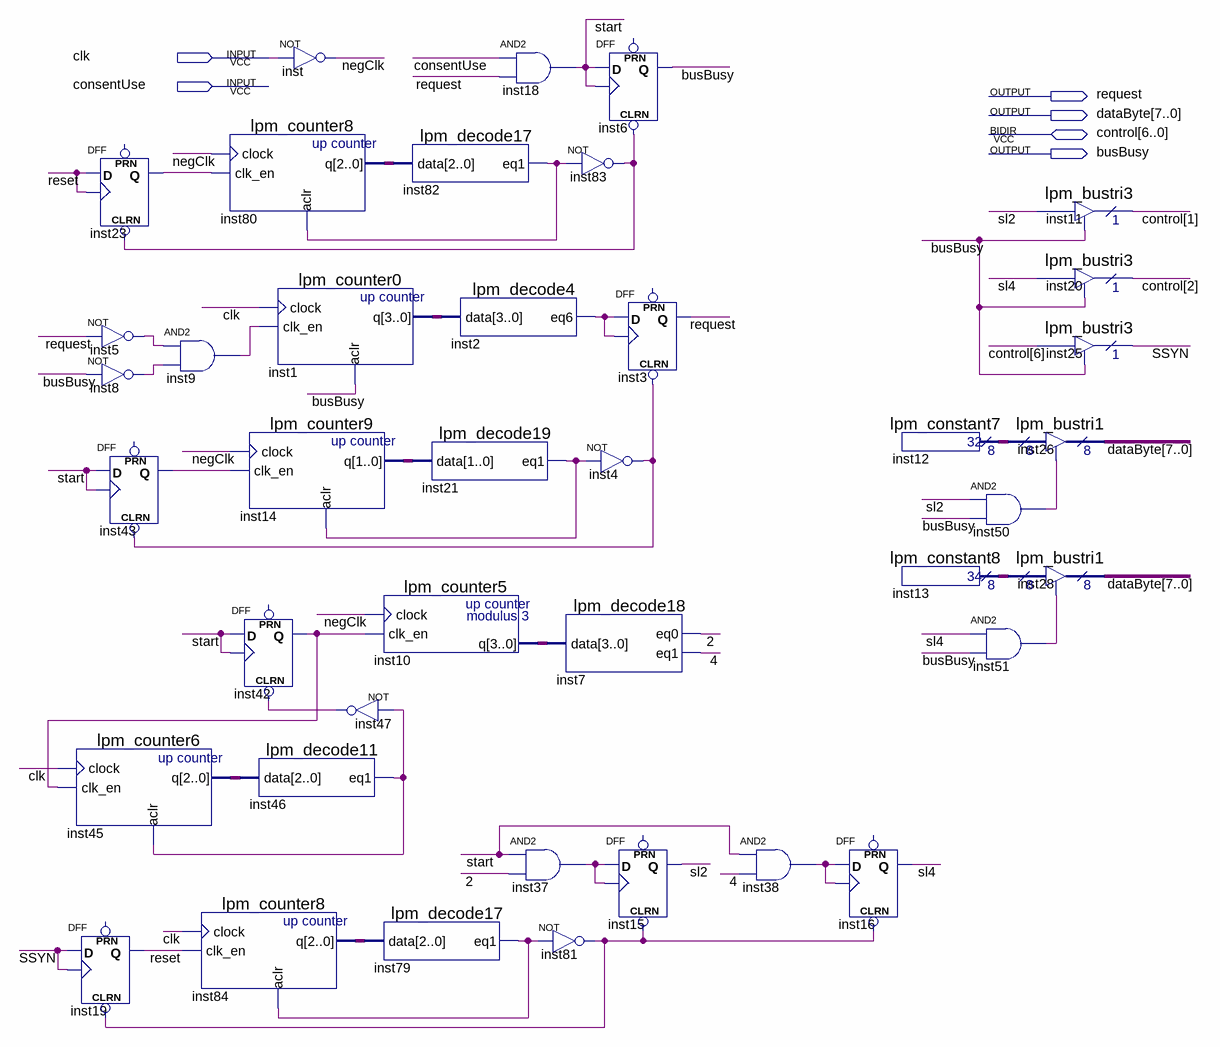
[diagram p0: schematic sheet]
// Quartus schematic Master3.bdf as structural Verilog: 40 symbols, 6 pins
module Master3 (
  input  clk,
  input  consentUse,
  inout  [6:0] control,
  output request,
  output [7:0] dataByte,
  output busBusy
);

  wire \2 , \4 , inst2_eq6, inst4_out, inst5_out, inst8_out, inst9_out, inst21_eq1, inst23_q, inst37_out,
       inst38_out, inst42_q, inst43_q, inst46_eq1, inst47_out, inst50_out, inst51_out, inst79_eq1,
       inst81_out, inst82_eq1, inst83_out, negClk, reset, sl2, sl4, SSYN, start;
  wire [1:0] inst14_q;
  wire [2:0] inst45_q, inst80_q, inst84_q;
  wire [3:0] inst1_q, inst10_q;
  wire [7:0] inst12_result, inst13_result;

  lpm_counter6 inst45 (.clock(clk), .clk_en(inst42_q), .aclr(inst46_eq1), .q(inst45_q));
  DFF inst19 (.CLRN(inst81_out), .CLK(SSYN), .D(SSYN), .Q(reset));  // open: PRN
  DFF inst23 (.CLRN(inst83_out), .CLK(reset), .D(reset), .Q(inst23_q));  // open: PRN
  not inst5 (inst5_out, request);
  not inst8 (inst8_out, busBusy);
  DFF inst43 (.CLRN(inst4_out), .CLK(start), .D(start), .Q(inst43_q));  // open: PRN
  lpm_counter8 inst80 (.clock(negClk), .clk_en(inst23_q), .aclr(inst82_eq1), .q(inst80_q));
  and inst9 (inst9_out, inst5_out, inst8_out);
  lpm_counter8 inst84 (.clock(clk), .clk_en(reset), .aclr(inst79_eq1), .q(inst84_q));
  not inst (negClk, clk);
  lpm_counter0 inst1 (.clock(clk), .clk_en(inst9_out), .aclr(busBusy), .q(inst1_q));
  lpm_counter9 inst14 (.clock(negClk), .clk_en(inst43_q), .aclr(inst21_eq1), .q(inst14_q));
  DFF inst42 (.CLRN(inst47_out), .CLK(start), .D(start), .Q(inst42_q));  // open: PRN
  lpm_decode11 inst46 (.data(inst45_q), .eq1(inst46_eq1));
  lpm_counter5 inst10 (.clock(negClk), .clk_en(inst42_q), .q(inst10_q));
  not inst47 (inst47_out, inst46_eq1);
  lpm_decode17 inst79 (.data(inst84_q), .eq1(inst79_eq1));
  lpm_decode17 inst82 (.data(inst80_q), .eq1(inst82_eq1));
  lpm_decode4 inst2 (.data(inst1_q), .eq6(inst2_eq6));
  lpm_decode19 inst21 (.data(inst14_q), .eq1(inst21_eq1));
  and inst18 (start, consentUse, request);
  and inst37 (inst37_out, start, \2 );
  DFF inst6 (.CLRN(inst83_out), .CLK(start), .D(start), .Q(busBusy));  // open: PRN
  not inst83 (inst83_out, inst82_eq1);
  not inst4 (inst4_out, inst21_eq1);
  lpm_decode18 inst7 (.data(inst10_q), .eq0(\2 ), .eq1(\4 ));
  DFF inst15 (.CLRN(inst81_out), .CLK(inst37_out), .D(inst37_out), .Q(sl2));  // open: PRN
  not inst81 (inst81_out, inst79_eq1);
  DFF inst3 (.CLRN(inst4_out), .CLK(inst2_eq6), .D(inst2_eq6), .Q(request));  // open: PRN
  and inst38 (inst38_out, start, \4 );
  DFF inst16 (.CLRN(inst81_out), .CLK(inst38_out), .D(inst38_out), .Q(sl4));  // open: PRN
  lpm_constant7 inst12 (.result(inst12_result));
  lpm_constant8 inst13 (.result(inst13_result));
  and inst50 (inst50_out, sl2, busBusy);
  and inst51 (inst51_out, sl4, busBusy);
  lpm_bustri3 inst11 (.enabledt(busBusy), .data(sl2), .tridata(control[1]));
  lpm_bustri3 inst20 (.enabledt(busBusy), .data(sl4), .tridata(control[2]));
  lpm_bustri3 inst25 (.enabledt(busBusy), .data(control[6]), .tridata(SSYN));
  lpm_bustri1 inst26 (.enabledt(inst50_out), .data(inst12_result), .tridata(dataByte));
  lpm_bustri1 inst28 (.enabledt(inst51_out), .data(inst13_result), .tridata(dataByte));
endmodule
